# EAGLE design try_container3_1 (EAGLE 9.4.2)
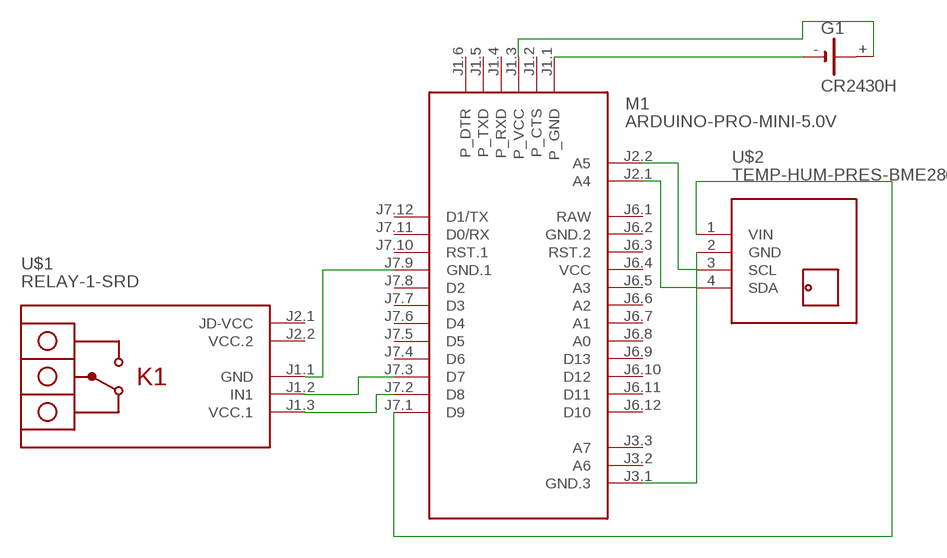
[diagram p0: schematic, sheet 1]

## Parts
G1  CR2430H  [CR2430H]
M1  ARDUINO-PRO-MINI-5.0V  [ARDUINO-PRO-MINI]
U$1  RELAY-1-SRD  [RELAY-1-SRD]
U$2  TEMP-HUM-PRES-BME280  [TEMP-HUM-PRES-BME280]

## Nets
N$1: M1.J2.2(A5) U$2.3(SCL)
N$2: M1.J2.1(A4) U$2.4(SDA)
N$3: M1.J3.1(GND.3) U$2.2(GND)
N$4: M1.J7.1(D9) U$2.1(VIN)
N$5: M1.J7.3(D7) U$1.J1.2(IN1)
N$6: M1.J7.2(D8) U$1.J1.3(VCC.1)
N$7: M1.J7.9(GND.1) U$1.J1.1(GND)
N$8: G1.+ M1.J1.3(P_VCC)
N$9: G1.- M1.J1.1(P_GND)
Unconnected: G1.+@1(+) M1.J1.2(P_CTS) M1.J1.4(P_RXD) M1.J1.5(P_TXD) M1.J1.6(P_DTR) M1.J3.2(A6) M1.J3.3(A7) M1.J6.3(RST.2) M1.J6.5(A3) M1.J6.6(A2) M1.J6.7(A1) M1.J6.8(A0) M1.J6.9(D13) M1.J6.10(D12) M1.J6.11(D11) M1.J6.12(D10) M1.J7.4(D6) M1.J7.5(D5) M1.J7.6(D4) M1.J7.7(D3) M1.J7.8(D2) M1.J7.10(RST.1) M1.J7.11(D0/RX) M1.J7.12(D1/TX) U$1.J2.1(JD-VCC)

## Power pins joined to a net without a drawn wire
GND.2: M1.J6.2(GND.2)
RAW: M1.J6.1(RAW)
VCC: M1.J6.4(VCC)
VCC.2: U$1.J2.2(VCC.2)

## Library data of the parts
G1 = battery:CR2430H: LI BATTERY Varta
M1 = diy-modules:ARDUINO-PRO-MINI-*: Arduino Pro Mini and compatible devices More details available here: https://www.arduino.cc/en/Main/ArduinoBoardProMini Click here to find device on ebay.com <http://www.ebay.com/sch/arduino+pro+mini>
U$1 = diy-modules:RELAY-1-SRD: 1-Channel Relay Module based on SRD-05VDC-SL-C relays Click here to find device on ebay.com <http://www.ebay.com/sch/one+channel+isolated+relay+5v>
U$2 = diy-modules (1):TEMP-HUM-PRES-BME280: Digital Humidity-Temperature-Pressure Sensor based on BME280 device More information about BME280 device is available here: https://www.bosch-sensortec.com/bst/products/all_products/bme280 Click here to find device on ebay.com <http://www.ebay.com/sch/bme280+breakout>

## Board
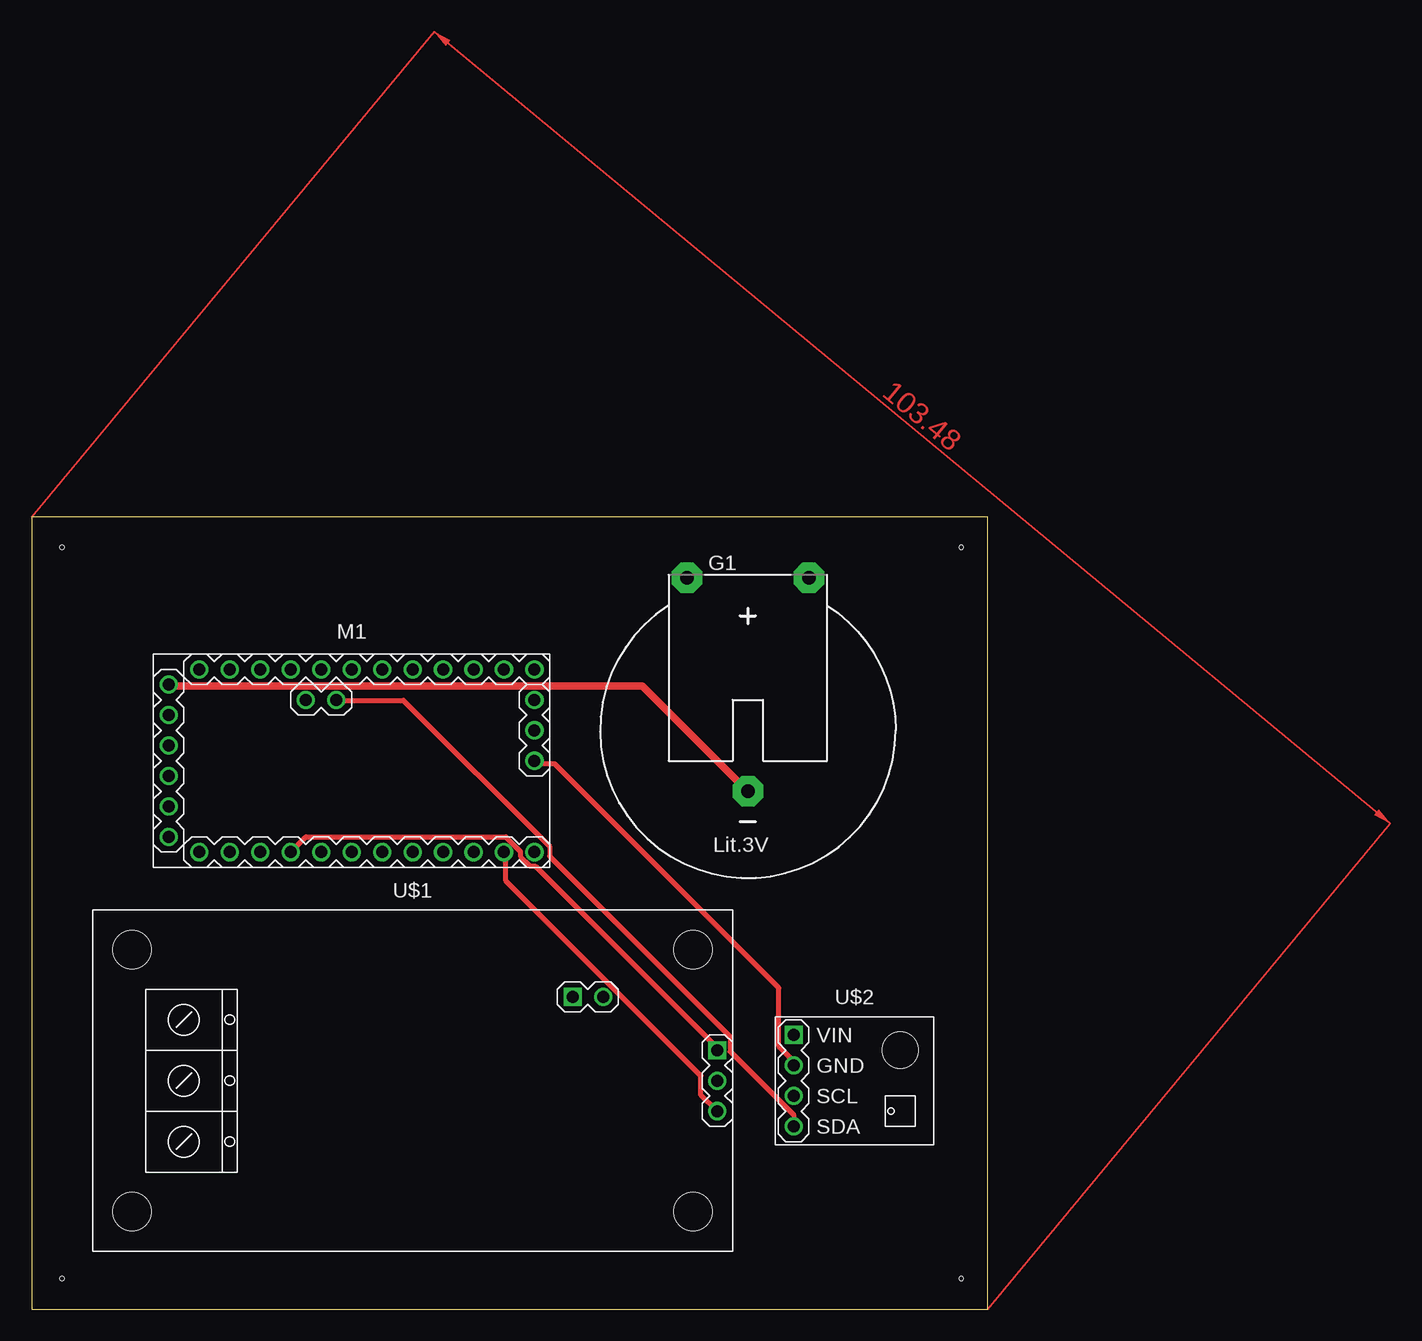
[diagram p1: board, top side]
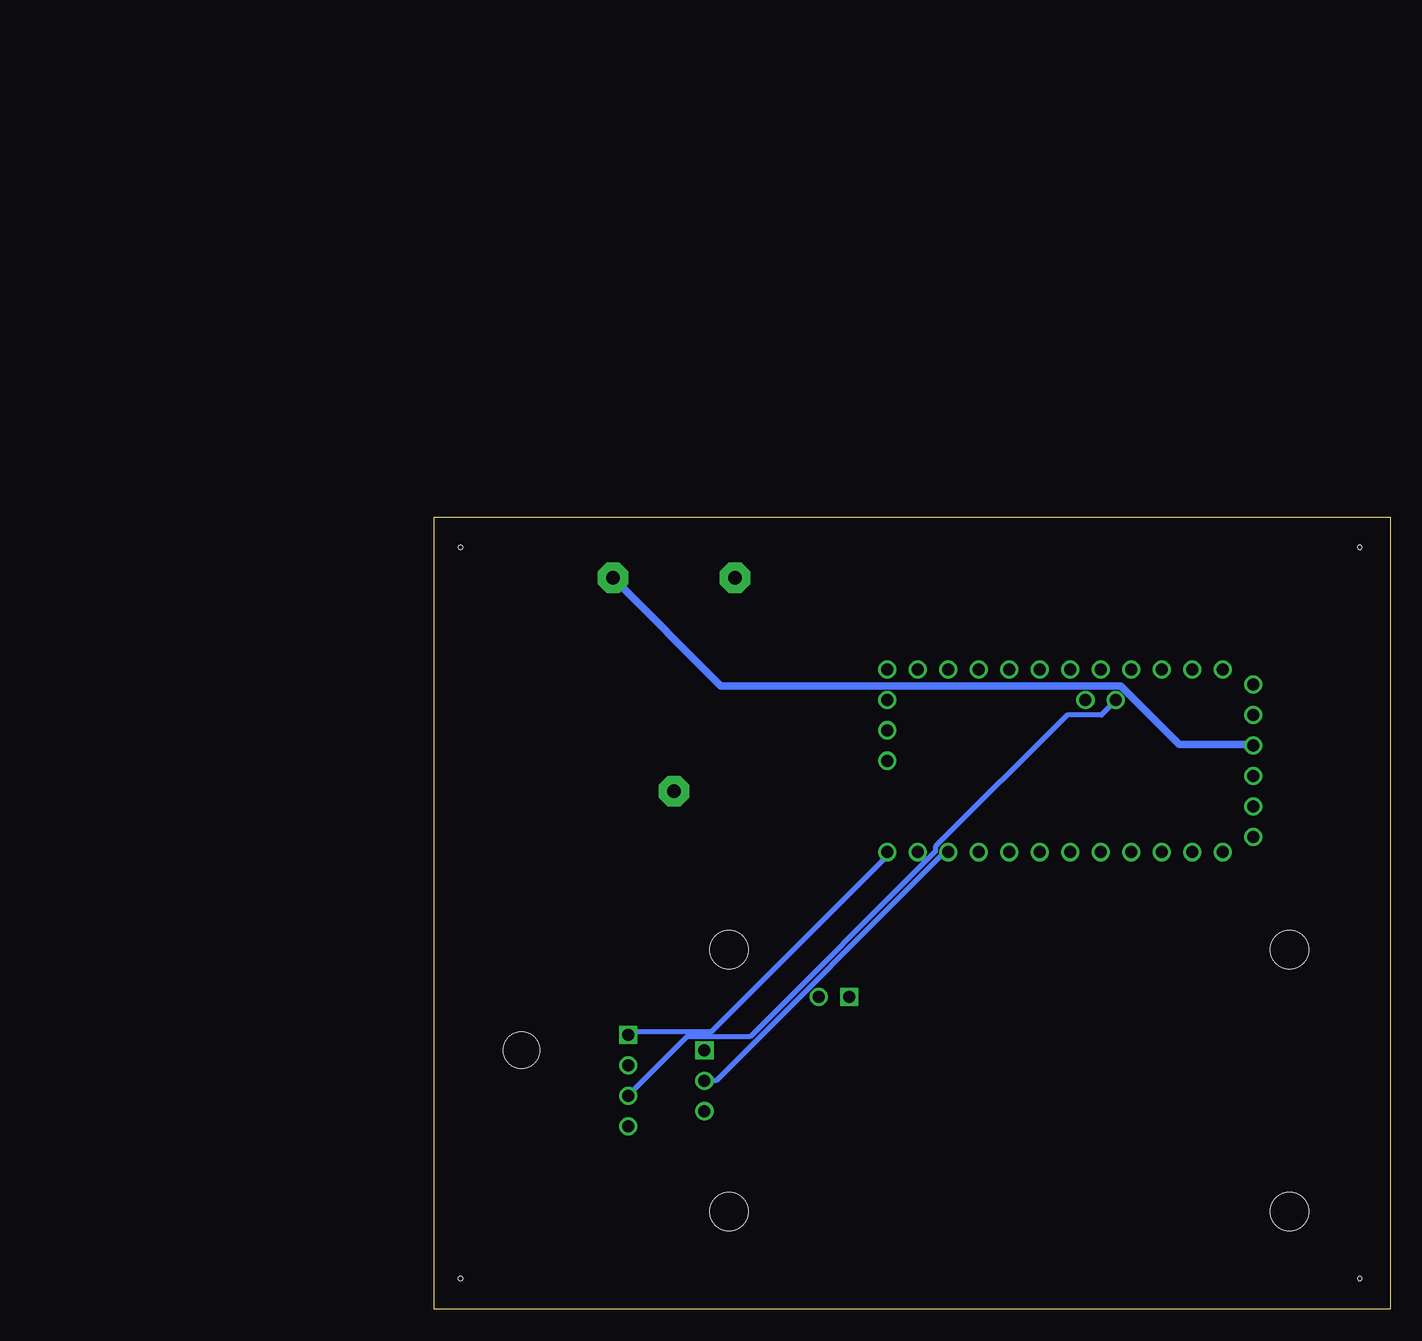
[diagram p2: board, bottom side, seen from below]

Size 79.68 x 66.03 mm. Coordinates in mm from the lower left corner, seen from the top.
Outline: 0,0 79.68,0 79.68,66.03 0,66.03 0,0
Copper layers (1*16): Top 0.035mm / dielectric 1.5mm / Bottom 0.035mm
Design rules "default": minimum track width 6mil, minimum drill 0.35mm, track to track 6mil, track to pad 6mil, pad to pad 6mil, via to via 6mil, smd to smd 6mil, copper to edge 40mil, drill to drill 6mil, minimum pad ring 10mil, minimum via ring 8mil, stop-mask expansion 4mil, vias tented up to drill 0mil, thermal gap 10mil
Holes 0.35 mm at 2.54,63.5 77.47,63.5 77.47,2.54 2.54,2.54

### Footprints (pad centres in the part's own frame; a part is rotated, then mirrored left to right if it is on the bottom)
CR2430H = drill 1.118 pad 2.54 octagon: + 5.08,12.7; +@1 -5.08,12.7; - 0,-5.08
ARDUINO-PRO-MINI = drill 1: J1.1 -15.24,6.35; J1.2 -15.24,3.81; J1.3 -15.24,1.27; J1.4 -15.24,-1.27; J1.5 -15.24,-3.81; J1.6 -15.24,-6.35; J2.1 -1.27,5.08; J2.2 -3.81,5.08; J3.1 15.24,0; J3.2 15.24,2.54; J3.3 15.24,5.08; J6.1 -12.7,7.62; J6.2 -10.16,7.62; J6.3 -7.62,7.62; J6.4 -5.08,7.62; J6.5 -2.54,7.62; J6.6 0,7.62; J6.7 2.54,7.62; J6.8 5.08,7.62; J6.9 7.62,7.62; J6.10 10.16,7.62; J6.11 12.7,7.62; J6.12 15.24,7.62; J7.1 15.24,-7.62; J7.2 12.7,-7.62; J7.3 10.16,-7.62; J7.4 7.62,-7.62; J7.5 5.08,-7.62; J7.6 2.54,-7.62; J7.7 0,-7.62; J7.8 -2.54,-7.62; J7.9 -5.08,-7.62; J7.10 -7.62,-7.62; J7.11 -10.16,-7.62; J7.12 -12.7,-7.62
RELAY-1-SRD = drill 1 square: J1.1 25.4,2.54; J2.1 13.335,6.985 | drill 1: J1.2 25.4,0; J1.3 25.4,-2.54; J2.2 15.875,6.985 | hole 3.2: -23.368,10.922; 23.368,10.922; 23.368,-10.922; -23.368,-10.922
TEMP-HUM-PRES-BME280 = drill 1 square: 1 -5.08,3.81 | drill 1: 2 -5.08,1.27; 3 -5.08,-1.27; 4 -5.08,-3.81 | hole 3: 3.81,2.54

### Placement (x,y rotation side)
G1  59.69,48.26 0 top
M1  26.67,45.72 0 top
U$1  31.75,19.05 0 top
U$2  68.58,19.05 0 top

### Tracks (layer width: path | path; a pad name or v marks a point on that pad's centre or on a via)
N$1
  Bottom 0.406: U$2.3 63.5,17.83 58.62,22.71 53.34,22.71 37.9,38.15 37.9,38.56 26.92,49.53 24.08,49.53 22.86,50.75 M1.J2.2
N$2
  Top 0.406: U$2.4 63.5,16.21 58.22,21.49 58.22,22.71 43.18,37.74 43.18,38.56 30.99,50.75 25.71,50.75 M1.J2.1
N$3
  Top 0.406: M1.J3.1 41.96,45.47 43.59,45.47 62.28,26.77 62.28,21.89 63.5,20.68 U$2.2
N$4
  Bottom 0.406: U$2.1 63.5,23.11 56.59,23.11 41.96,37.74 M1.J7.1
N$5
  Bottom 0.406: U$1.J1.2 56.19,19.05 37.08,38.15 M1.J7.3
N$6
  Top 0.406: M1.J7.2 39.52,37.74 39.52,35.71 55.78,19.46 55.78,17.83 57,16.61 U$1.J1.3
N$7
  Top 0.406: M1.J7.9 22.86,39.37 39.52,39.37 40.74,38.15 40.74,37.74 41.55,36.93 41.96,36.93 57,21.89 U$1.J1.1
N$8
  Bottom 0.406: 11.48,47.09 M1.J1.3
  Bottom 0.61: 11.48,47.09 17.58,47.09 22.45,51.97 55.78,51.97 G1.+
N$9
  Top 0.406: 11.48,51.97 M1.J1.1
  Top 0.61: 11.48,51.97 50.9,51.97 G1.-
(copper drawn outside any net)
  shapes: Top area x1